# Altium schematic sheet Connector.SchDoc: Motherboard Connector
size A; DrawnBy: Diego Gomez Canales; DocumentNumber: SCH-1; Revision: 1.0; SheetNumber: 1; SheetTotal: 4; ProjectName: CISCO AP
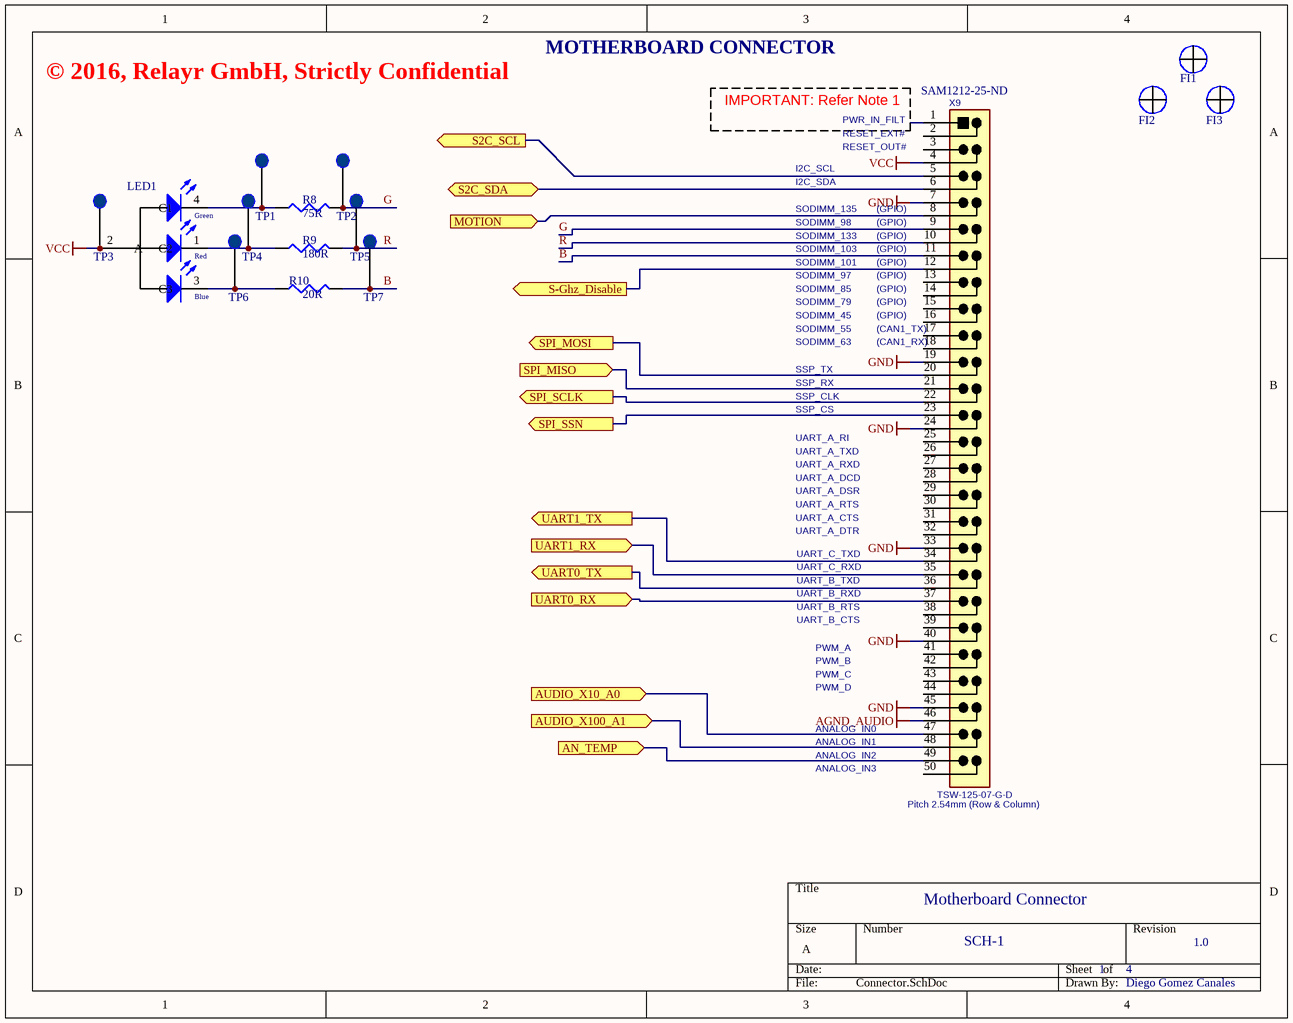
[diagram p0: Connector.SchDoc]

## Parts
FI1  Fidutial  [FIDU]  (value not drawn)
FI2  Fidutial  [FIDU]  (value not drawn)
FI3  Fidutial  [FIDU]  (value not drawn)
LED1  WE-LED_RGB_A1B2R3G4-4  [3528_A]  (value not drawn)
R8  value 75R  [6-0805_N]  (hidden comment: Res3)
R9  value 180R  [6-0805_N]  (hidden comment: Res3)
R10  value 20R  [6-0805_N]  (hidden comment: Res3)
TP1  TEST_POINT  [TP]  (value not drawn)
TP2  TEST_POINT  [TP]  (value not drawn)
TP3  TEST_POINT  [TP]  (value not drawn)
TP4  TEST_POINT  [TP]  (value not drawn)
TP5  TEST_POINT  [TP]  (value not drawn)
TP6  TEST_POINT  [TP]  (value not drawn)
TP7  TEST_POINT  [TP]  (value not drawn)
X9  Supplier Part Number 1: SAM1212-25-ND  [CISCO_AP_SSW-125-01-X-D]  (hidden comment: TSW-125-07-G-D)

## Ports
AN_TEMP (in), AUDIO_X10_A0 (in), AUDIO_X100_A1 (in), MOTION (in), S2C_SCL (out), S2C_SDA (bidir), S-Ghz_Disable (out), SPI_MISO (in), SPI_MOSI (out), SPI_SCLK (out), SPI_SSN (out), UART0_RX (in), UART0_TX (out), UART1_RX (in), UART1_TX (out)

## Nets
AGND_AUDIO: X9.46
GND: X9.7 X9.19 X9.24 X9.33 X9.40 X9.45
VCC: LED1.2(A) TP3.1 X9.4
AN_TEMP: X9.49 ; port AN_TEMP
AUDIO_X10_A0: X9.47 ; port AUDIO_X10_A0
AUDIO_X100_A1: X9.48 ; port AUDIO_X100_A1
B: R10.2 TP7.1 X9.11
G: R8.2 TP2.1 X9.9
MOTION: X9.8 ; port MOTION
R: R9.2 TP5.1 X9.10
S2C_SCL: X9.5 ; port S2C_SCL
S2C_SDA: X9.6 ; port S2C_SDA
S-Ghz_Disable: X9.12 ; port S-Ghz_Disable
SPI_MISO: X9.21 ; port SPI_MISO
SPI_MOSI: X9.20 ; port SPI_MOSI
SPI_SCLK: X9.22 ; port SPI_SCLK
SPI_SSN: X9.23 ; port SPI_SSN
UART0_RX: X9.37 ; port UART0_RX
UART0_TX: X9.36 ; port UART0_TX
UART1_RX: X9.35 ; port UART1_RX
UART1_TX: X9.34 ; port UART1_TX
NetLED1_1: LED1.1(C2) R9.1 TP4.1
NetLED1_3: LED1.3(C3) R10.1 TP6.1
NetLED1_4: LED1.4(C1) R8.1 TP1.1

Not connected (* = marked no-connect by the designer): X9 1 2 3 13 14 15 16 17 18 25 26 27 28 29 30 31 32 38 39 41 42 43 44 50

## Notes on the sheet
- © 2016, Relayr GmbH, Strictly Confidential
- MOTHERBOARD CONNECTOR
- IMPORTANT: Refer Note 1
- RESET_EXT#
- RESET_OUT#
- PWR_IN_FILT
- SODIMM_135
- SODIMM_98
- I2C_SCL
- I2C_SDA
- (near X9) (GPIO)
- SODIMM_133
- SODIMM_103
- SODIMM_101
- SODIMM_97
- SODIMM_85
- SODIMM_79
- SODIMM_55
- SODIMM_63
- SODIMM_45
- SSP_TX
- (near X9) (CAN1_TX)
- (near X9) (CAN1_RX)
- SSP_CLK
- SSP_CS
- SSP_RX
- UART_A_RI
- UART_A_TXD
- UART_A_RXD
- UART_A_DCD
- UART_A_DSR
- UART_A_RTS
- UART_A_CTS
- UART_A_DTR
- UART_C_TXD
- UART_C_RXD
- UART_B_RTS
- UART_B_CTS
- UART_B_TXD
- UART_B_RXD
- PWM_C
- PWM_D
- PWM_A
- PWM_B
- ANALOG_IN2
- ANALOG_IN3
- ANALOG_IN0
- ANALOG_IN1
- (near X9) Pitch 2.54mm (Row & Column)
- (in symbol WE-LED_RGB_A1B2R3G4-4) Green; Red; Blue

## Library data of the parts
FI1-FI3 = Fidutial: Fidutial_component
R8-R10 = Res3: Resistor; Published: 8-Jun-2000; LatestRevisionDate: 29-May-2009; LatestRevisionNote: IPC-7351 Footprint Added.; PackageReference: J1-0603; Publisher: Altium Limited; PackageDescription: Chip Resistor; Supplier 1: Digi-Key
  R8: Supplier Part Number 1: RNCP0805FTD75R0CT-ND
  R9: Supplier Part Number 1: RNCP0805FTD180RTR-ND
  R10: Supplier Part Number 1: RNCP0805FTD20R0CT-ND
TP1-TP7 = TEST_POINT: Point of test to manufacturing
X9 = CON-Samtec-TSW-125-07-G-D-Male: Header, 2x25 Pins, 2.54 mm pitch; Manufacturer: Samtec; Pitch: 2.54mm; No. of ways: 2x25; Manufacturer Part Number: TSW-125-07-G-D; Supplier 1: Digi-Key
LED1 = WE-LED_RGB_A1B2R3G4-4: Supplier 1: Digi-Key; Supplier Part Number 1: CLVBA-FKA-CAEDH8BBB7A363CT-ND